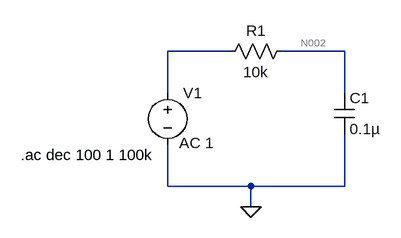
[diagram p0: schematic 2_Zadatak_lab1.asc]
2_Zadatak_lab1.asc, the LTspice schematic file:
Version 4
SHEET 1 880 680
WIRE 144 128 48 128
WIRE 320 128 224 128
WIRE 48 192 48 128
WIRE 320 192 320 128
WIRE 48 336 48 272
WIRE 176 336 48 336
WIRE 320 336 320 256
WIRE 320 336 176 336
WIRE 176 368 176 336
FLAG 176 368 0
SYMBOL res 240 112 R90
WINDOW 0 0 56 VBottom 2
WINDOW 3 32 56 VTop 2
SYMATTR InstName R1
SYMATTR Value 10k
SYMBOL cap 304 192 R0
SYMATTR InstName C1
SYMATTR Value 0.1µ
SYMBOL voltage 48 176 R0
WINDOW 123 18 93 Left 2
WINDOW 39 0 0 Left 0
SYMATTR InstName V1
SYMATTR Value ""
SYMATTR Value2 AC 1
TEXT -178 288 Left 2 !.ac dec 100 1 100k

The netlist it stands for:
* 2_Zadatak_lab1.asc
R1 N002 N001 10k
C1 N002 0 0.1µ
V1 N001 0 AC 1
.ac dec 100 1 100k
.backanno
.end

* Results of the author's LTspice run, read from the files saved beside the schematic
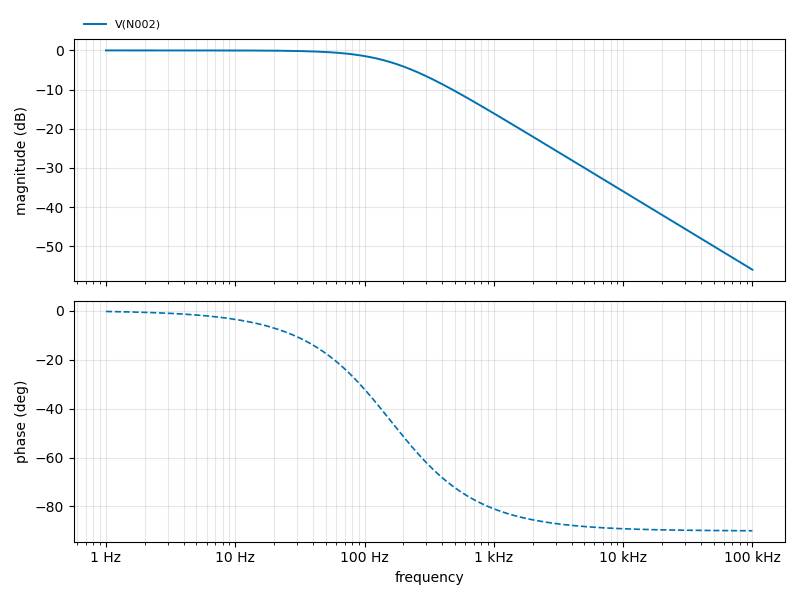
[diagram p1: AC Analysis of 2_Zadatak_lab1.asc, plotted from the saved traces]
* AC Analysis, 1 run:
*   V(N002): -0.00 dB at 1 Hz, -55.96 dB at 100 kHz, peak -0.00 dB at 1 Hz, 3 dB below the peak at 159.2 Hz